# EAGLE schematic Thetis_RevG2_SCH v1 (EAGLE 9.7.0)
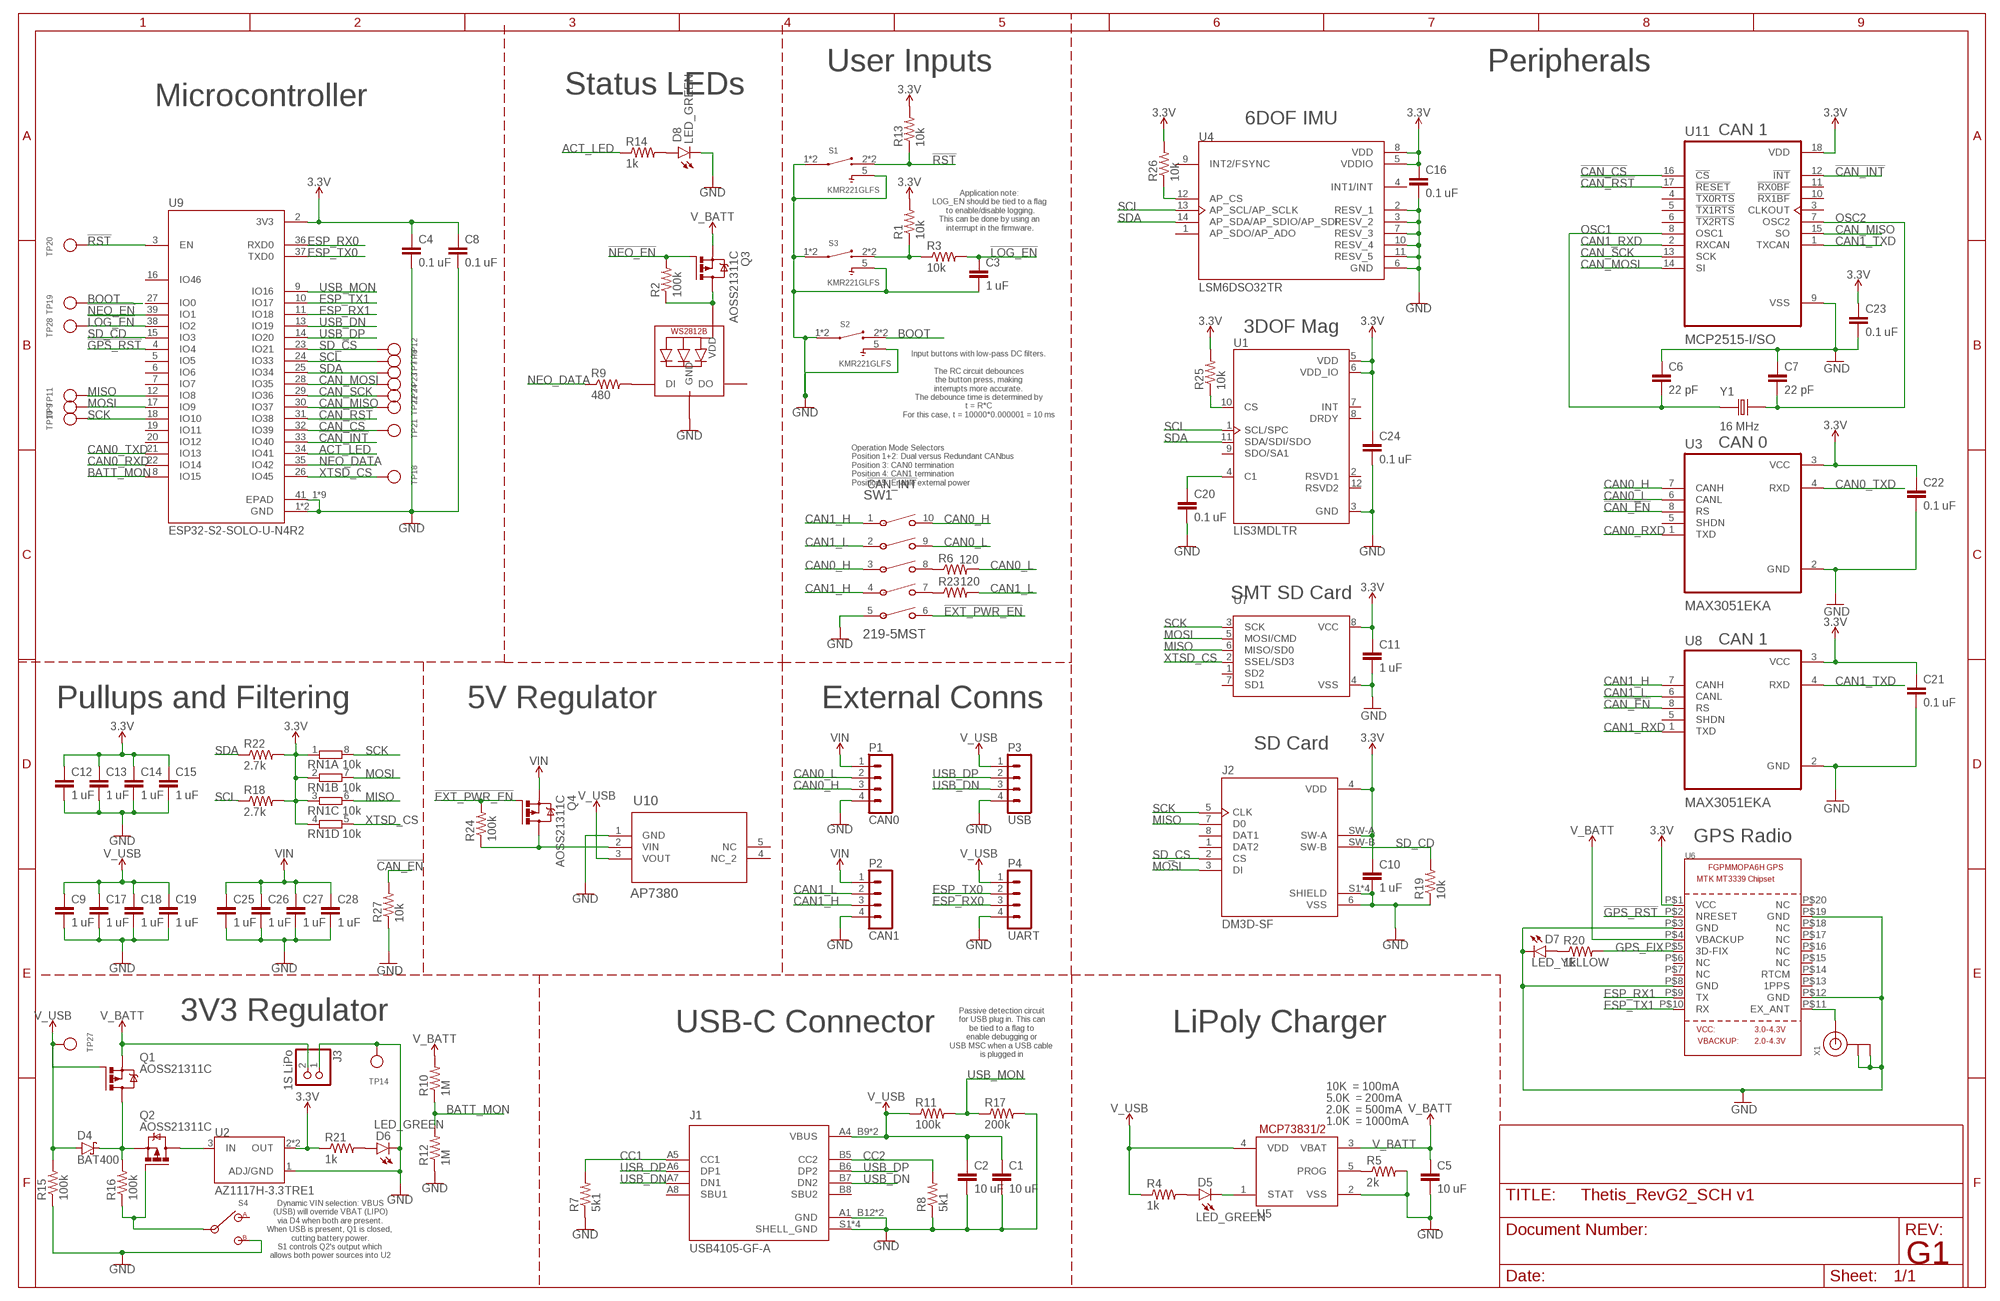
[diagram p0: schematic, sheet 1]

## Parts
C1  10 uF  C-EUC0603  [C0603]
C2  10 uF  C-EUC0603  [C0603]
C3  1 uF  C-EUC0603  [C0603]
C4  0.1 uF  C-EUC0603  [C0603]
C5  10 uF  C-EUC0603  [C0603]
C6  22 pF  C-EUC0603  [C0603]
C7  22 pF  C-EUC0603  [C0603]
C8  0.1 uF  C-EUC0603  [C0603]
C9  1 uF  C-EUC0603  [C0603]
C10  1 uF  C-EUC0603  [C0603]
C11  1 uF  C-EUC0603  [C0603]
C12  1 uF  C-EUC0603  [C0603]
C13  1 uF  C-EUC0603  [C0603]
C14  1 uF  C-EUC0603  [C0603]
C15  1 uF  C-EUC0603  [C0603]
C16  0.1 uF  C-EUC0603  [C0603]
C17  1 uF  C-EUC0603  [C0603]
C18  1 uF  C-EUC0603  [C0603]
C19  1 uF  C-EUC0603  [C0603]
C20  0.1 uF  C-EUC0603  [C0603]
C21  0.1 uF  C-EUC0603  [C0603]
C22  0.1 uF  C-EUC0603  [C0603]
C23  0.1 uF  C-EUC0603  [C0603]
C24  0.1 uF  C-EUC0603  [C0603]
C25  1 uF  C-EUC0603  [C0603]
C26  1 uF  C-EUC0603  [C0603]
C27  1 uF  C-EUC0603  [C0603]
C28  1 uF  C-EUC0603  [C0603]
D4  BAT400  BAS40  [SOT23]
D5  LED_GREEN  CHIP-ROUND-G_0603  [LEDC1608X65N_RND-G]
D6  LED_GREEN  CHIP-ROUND-G_0603  [LEDC1608X65N_RND-G]
D7  LED_YELLOW  CHIP-FLAT-Y_0603-0.35MM  [LEDC1608X35N_FLAT-Y]
D8  LED_GREEN  CHIP-ROUND-G_0603  [LEDC1608X65N_RND-G]
J1  USB4105-GF-A  [GCT_USB4105-GF-A]
J2  DM3D-SF  [HRS_DM3D-SF]
J3  1S LiPo  JST_2PIN  [JSTPH2]
LED1  WS2812B3535  [LED3535]
P1  CAN0  B4B-PH-K  [B4B-PH-K]
P2  CAN1  B4B-PH-K  [B4B-PH-K]
P3  USB  B4B-PH-K  [B4B-PH-K]
P4  UART  B4B-PH-K  [B4B-PH-K]
Q1  AOSS21311C  PMOSFET_BSS84  [SOT23]
Q2  AOSS21311C  PMOSFET_BSS84  [SOT23]
Q3  AOSS21311C  PMOSFET_BSS84  [SOT23]
Q4  AOSS21311C  PMOSFET_BSS84  [SOT23]
R1  10k  R-US_R0603  [R0603]
R2  100k  R-US_R0603  [R0603]
R3  10k  R-US_R0603  [R0603]
R4  1k  R-US_R0603  [R0603]
R5  2k  R-US_R0603  [R0603]
R6  120  R-US_R0603  [R0603]
R7  5k1  R-US_R0603  [R0603]
R8  5k1  R-US_R0603  [R0603]
R9  480  R-US_R0603  [R0603]
R10  1M  R-US_R0603  [R0603]
R11  100k  R-US_R0603  [R0603]
R12  1M  R-US_R0603  [R0603]
R13  10k  R-US_R0603  [R0603]
R14  1k  R-US_R0603  [R0603]
R15  100k  R-US_R0603  [R0603]
R16  100k  R-US_R0603  [R0603]
R17  200k  R-US_R0603  [R0603]
R18  2.7k  R-US_R0603  [R0603]
R19  10k  R-US_R0603  [R0603]
R20  1k  R-US_R0603  [R0603]
R21  1k  R-US_R0603  [R0603]
R22  2.7k  R-US_R0603  [R0603]
R23  120  R-US_R0603  [R0603]
R24  100k  R-US_R0603  [R0603]
R25  10k  R-US_R0603  [R0603]
R26  10k  R-US_R0603  [R0603]
R27  10k  R-US_R0603  [R0603]
RN1  10k  4R-NEXBV8V  [EXBV8V]
S1  KMR221GLFS  [SW_KMR221GLFS]
S2  KMR221GLFS  [SW_KMR221GLFS]
S3  KMR221GLFS  [SW_KMR221GLFS]
S4  CL-SB-12X  [CL-SB-12A]
SW1  219-5MST  219-5MSTSW5_219SMT  [SW5_219SMT]
TP7  TESTPOINT1.5X2.0MM_NOCREAM  [PAD-1.5X2.0]
TP8  TESTPOINT1.5X2.0MM_NOCREAM  [PAD-1.5X2.0]
TP9  TESTPOINT1.5X2.0MM_NOCREAM  [PAD-1.5X2.0]
TP10  TESTPOINT1.5X2.0MM_NOCREAM  [PAD-1.5X2.0]
TP11  TESTPOINT1.5X2.0MM_NOCREAM  [PAD-1.5X2.0]
TP12  TESTPOINT1.5X2.0MM_NOCREAM  [PAD-1.5X2.0]
TP14  TESTPOINT1.5X2.0MM_NOCREAM  [PAD-1.5X2.0]
TP18  TESTPOINT1.5X2.0MM_NOCREAM  [PAD-1.5X2.0]
TP19  TESTPOINT1.5X2.0MM_NOCREAM  [PAD-1.5X2.0]
TP20  TESTPOINT1.5X2.0MM_NOCREAM  [PAD-1.5X2.0]
TP21  TESTPOINT1.5X2.0MM_NOCREAM  [PAD-1.5X2.0]
TP22  TESTPOINT1.5X2.0MM_NOCREAM  [PAD-1.5X2.0]
TP23  TESTPOINT1.5X2.0MM_NOCREAM  [PAD-1.5X2.0]
TP24  TESTPOINT1.5X2.0MM_NOCREAM  [PAD-1.5X2.0]
TP27  TESTPOINT1.5X2.0MM_NOCREAM  [PAD-1.5X2.0]
TP28  TESTPOINT1.5X2.0MM_NOCREAM  [PAD-1.5X2.0]
U1  LIS3MDLTR  [XDCR_LIS3MDLTR]
U2  AZ1117H-3.3TRE1  AZ1117EH-5.0TRG1  [SOT230P700X180-4N]
U3  MAX3051EKA  [SOT65P280X145-8N]
U4  LSM6DSO32TR  [PQFN50P300X250X97-14N]
U5  MCP73831/OT  [SOT23-5L]
U6  GPS_FGPMMOPA6H  [FGPMMOPA6H]
U7  SMT_SDCARD_8PIN  [LGA8_8X6]
U8  MAX3051EKA  [SOT65P280X145-8N]
U9  ESP32-S2-SOLO-U-N4R2  [XCVR_ESP32-S2-SOLO-U-N4R2]
U10  AP7380  AP7380-50WR-7SOT_50WR-7_DIO-L  [SOT_50WR-7_DIO-L]
U11  MCP2515-I/SO  [SOIC127P1030X265-18N]
X1  ANTENNA_U.FL  [U.FL]
Y1  16 MHz  ECS-160-20-3X-TR  [XTAL_ECS-160-20-3X-TR]

## Nets
3.3V: C4.1 C8.1 C10.1 C11.1 C12.1 C13.1 C14.1 C15.1 C16.1 C21.1 C22.1 C23.1 C24.1 J2.4(VDD) J2.SW-A R1.2 R13.2 R18.2 R21.1 R22.2 R25.2 R26.2 RN1.1 RN1.2 RN1.3 RN1.4 U1.5(VDD) U1.6(VDD_IO) U2.2(OUT) U2.4(OUT) U3.3(VCC) U4.5(VDDIO) U4.8(VDD) U6.P$1(VCC) U7.8(VCC) U8.3(VCC) U9.2(3V3) U11.18(VDD)
!CAN_CS: TP21.P$1 U9.32(IO39) U11.16(!CS)
!CAN_EN: R27.2 U3.8(RS) U8.8(RS)
!CAN_INT: U9.33(IO40) U11.12(!INT)
!CAN_RST: U9.31(IO38) U11.17(!RESET)
!EXT_PWR_EN: Q4.1(G) R24.2 SW1.6
!GPS_RST: U6.P$2(NRESET) U9.4(IO4)
!LOG_EN: C3.1 R3.2 TP28.P$1 U9.38(IO2)
!NEO_EN: Q3.1(G) R2.2 U9.39(IO1)
!RST: R13.1 S1.2 S1.3 TP20.P$1 U9.3(EN)
ACT_LED: R14.1 U9.34(IO41)
BATT_MON: R10.1 R12.2 U9.8(IO15)
BOOT: S2.2 S2.3 TP19.P$1 U9.27(IO0)
CAN0_H: P1.3 SW1.3 SW1.10 U3.7(CANH)
CAN0_L: P1.2 R6.2 SW1.9 U3.6(CANL)
CAN0_RXD: U3.1(TXD) U9.22(IO14)
CAN0_TXD: U3.4(RXD) U9.21(IO13)
CAN1_H: P2.3 SW1.1 SW1.4 U8.7(CANH)
CAN1_L: P2.2 R23.2 SW1.2 U8.6(CANL)
CAN1_RXD: U8.1(TXD) U11.2(RXCAN)
CAN1_TXD: U8.4(RXD) U11.1(TXCAN)
CAN_MISO: TP22.P$1 U9.30(IO37) U11.15(SO)
CAN_MOSI: TP23.P$1 U9.28(IO35) U11.14(SI)
CAN_SCK: TP24.P$1 U9.29(IO36) U11.13(SCK)
CC1: J1.A5(CC1) R7.2
CC2: J1.B5(CC2) R8.2
ESP_RX0: P4.3 U9.36(RXD0)
ESP_RX1: U6.P$9(TX) U9.11(IO18)
ESP_TX0: P4.2 U9.37(TXD0)
ESP_TX1: U6.P$10(RX) U9.10(IO17)
GND: C1.2 C2.2 C3.2 C4.2 C5.2 C6.1 C7.1 C8.2 C9.2 C10.2 C11.2 C12.2 C13.2 C14.2 C15.2 C16.2 C17.2 C18.2 C19.2 C20.2 C21.2 C22.2 C23.2 C24.2 C25.2 C26.2 C27.2 C28.2 D6.C D7.C D8.C J1.A1_B12(GND) J1.B1_A12(GND) J1.S1(SHELL_GND) J1.S2(SHELL_GND) J1.S3(SHELL_GND) J1.S4(SHELL_GND) J2.6(VSS) J2.S1(SHIELD) J2.S2(SHIELD) J2.S3(SHIELD) J2.S4(SHIELD) J3.1 LED1.4(GND) P1.4 P2.4 P3.4 P4.4 R5.2 R7.1 R8.1 R12.1 R15.1 R17.2 R19.1 R27.1 S1.1 S1.4 S1.5 S2.1 S2.4 S2.5 S3.1 S3.4 S3.5 S4.3 SW1.5 TP14.P$1 U1.3(GND) U2.1(ADJ/GND) U3.2(GND) U4.2(RESV_1) U4.3(RESV_2) U4.6(GND) U4.7(RESV_3) U4.10(RESV_4) U4.11(RESV_5) U5.2(VSS) U6.P$3(GND) U6.P$8(GND) U6.P$12(GND) U6.P$19(GND) U7.4(VSS) U8.2(GND) U9.1(GND) U9.40(GND) U9.41_1(EPAD) U9.41_2(EPAD) U9.41_3(EPAD) U9.41_4(EPAD) U9.41_5(EPAD) U9.41_6(EPAD) U9.41_7(EPAD) U9.41_8(EPAD) U9.41_9(EPAD) U10.1(GND) U11.9(VSS) X1.1(GND) X1.2(GND)
GPS_FIX: R20.2 U6.P$5(3D-FIX)
MISO: J2.7(D0) RN1.6 TP11.P$1 U7.6(MISO/SD0) U9.12(IO8)
MOSI: J2.3(DI) RN1.7 TP9.P$1 U7.5(MOSI/CMD) U9.17(IO9)
N$1: Q2.1(G) R16.1 S4.2
N$2: D7.A R20.1
N$3: D8.A R14.2
N$4: R1.1 R3.1 S3.2 S3.3
N$5: LED1.2(VDD) Q3.3(D) R2.1
N$6: Q2.3(D) U2.3(IN)
N$7: C20.1 U1.4(C1)
N$8: LED1.1(DI) R9.2
N$10: U6.P$11(EX_ANT) X1.3(SIGNAL)
N$11: R6.1 SW1.8
N$12: R26.1 U4.12(AP_CS)
N$13: D4.3(C) Q1.3(D) Q2.2(S) R16.2
N$14: R23.1 SW1.7
N$15: R25.1 U1.10(CS)
N$16: Q4.3(D) R24.1 U10.2(VIN)
N$20: D5.A R4.2
N$21: D5.C U5.1(STAT)
N$22: R5.1 U5.5(PROG)
N$24: D6.A R21.2
NEO_DATA: R9.1 U9.35(IO42)
OSC1: C6.2 U11.8(OSC1) Y1.1
OSC2: C7.2 U11.7(OSC2) Y1.2
SCK: J2.5(CLK) RN1.8 TP10.P$1 U7.3(SCK) U9.18(IO10)
SCL: R18.1 TP8.P$1 U1.1(SCL/SPC) U4.13(AP_SCL/AP_SCLK) U9.24(IO33)
SD_CD: J2.SW-B R19.2 U9.15(IO3)
SD_CS: J2.2(CS) TP12.P$1 U9.23(IO21)
SDA: R22.1 TP7.P$1 U1.11(SDA/SDI/SDO) U4.14(AP_SDA/AP_SDIO/AP_SDI) U9.25(IO34)
USB_DN: J1.A7(DN1) J1.B7(DN2) P3.3 U9.13(IO19)
USB_DP: J1.A6(DP1) J1.B6(DP2) P3.2 U9.14(IO20)
USB_MON: R11.2 R17.1 U9.9(IO16)
V_BATT: C5.1 J3.2 Q1.2(S) Q3.2(S) R10.2 U5.3(VBAT) U6.P$4(VBACKUP)
V_USB: C1.1 C2.1 C9.1 C17.1 C18.1 C19.1 D4.1(A) J1.A4_B9(VBUS) J1.B4_A9(VBUS) P3.1 P4.1 Q1.1(G) R4.1 R11.1 R15.2 TP27.P$1 U5.4(VDD) U10.3(VOUT)
VIN: C25.1 C26.1 C27.1 C28.1 P1.1 P2.1 Q4.2(S)
XTSD_CS: RN1.5 TP18.P$1 U7.2(SSEL/SD3) U9.26(IO45)
Unconnected: J1.A8(SBU1) J1.B8(SBU2) J2.1(DAT2) J2.8(DAT1) LED1.3(DO) S4.1 U1.2(RSVD1) U1.7(INT) U1.8(DRDY) U1.9(SDO/SA1) U1.12(RSVD2) U3.5(SHDN) U4.1(AP_SDO/AP_ADO) U4.4(INT1/INT) U4.9(INT2/FSYNC) U6.P$6(NC) U6.P$7(NC) U6.P$13(1PPS) U6.P$14(RTCM) U6.P$15(NC) U6.P$16(NC) U6.P$17(NC) U6.P$18(NC) U6.P$20(NC) U7.1(SD2) U7.7(SD1) U8.5(SHDN) U9.5(IO5) U9.6(IO6) U9.7(IO7) U9.16(IO46) U9.19(IO11) U9.20(IO12) U10.4(NC_2) U10.5(NC) U11.3(CLKOUT) U11.4(!TX0RTS) U11.5(!TX1RTS) U11.6(!TX2RTS) U11.10(!RX1BF) U11.11(!RX0BF)

## Notes on the sheet
- User Inputs | Peripherals
- Status LEDs
- Microcontroller
- 6DOF IMU
- CAN 1
- Application note: 
  LOG_EN should be tied to a flag 
  to enable/disable logging.
  This can be done by using an 
  interrrupt in the firmware.
- 3DOF Mag
- Input buttons with low-pass DC filters.
  
  The RC circuit debounces
  the button press, making
  interrupts more accurate.
  The debounce time is determined by
  t = R*C
  For this case, t = 10000*0.000001 = 10 ms
- CAN 0
- Operation Mode Selectors
  Position 1+2: Dual versus Redundant CANbus
  Position 3: CAN0 termination
  Position 4: CAN1 termination
  Position 5: Enable external power
- SMT SD Card
- CAN 1
- Pullups and Filtering | 5V Regulator | External Conns
- SD Card
- GPS Radio
- 3V3 Regulator
- USB-C Connector | LiPoly Charger
- Passive detection circuit
  for USB plug in. This can
  be tied to a flag to
  enable debugging or
  USB MSC when a USB cable 
  is plugged in
- 10K  = 100mA
- 5.0K  = 200mA
- 2.0K  = 500mA
- 1.0K  = 1000mA
- Dynamic VIN selection: VBUS
  (USB) will override VBAT (LIPO)
  via D4 when both are present.
  When USB is present, Q1 is closed, 
  cutting battery power.
  S1 controls Q2's output which 
  allows both power sources into U2
- G1

## Library data of the parts
C1-C28 = rcl:C-EU: CAPACITOR, European symbol; SPICEPREFIX: C
D4 = diode:BAS40: Silicon Schottky Diodes General-purpose diode for high-speed switching
D5 D6 D8 = LED:CHIP-ROUND-G; CATEGORY: LED; COLOR: GREEN; DESCRIPTION: CHIP LED ROUND; SUB-CATEGORY: CHIP; TYPE: ROUND_TOP
D7 = LED:CHIP-FLAT-Y; CATEGORY: LED; COLOR: YELLOW; DESCRIPTION: CHIP LED FLAT; SUB-CATEGORY: CHIP; TYPE: FLAT_TOP
J1 = USB4105-GF-A:USB4105-GF-A: USB-C (USB TYPE-C) USB 2.0 Receptacle Connector 24 (16+8 Dummy) Position Surface Mount, Right Angle; Through Hole Check prices <https://pricing.snapeda.com/parts/USB4105-GF-A/GCT/view-part?ref=eda>; AVAILABILITY: In Stock; DESCRIPTION: USB-C (USB TYPE-C) USB 2.0 Receptacle Connector 24 (16+8 Dummy) Position Surface Mount, Right Angle; Through Hole; MF: GCT; MP: USB4105-GF-A; PACKAGE: None; PRICE: None; PURCHASE-URL: https://pricing.snapeda.com/search/part/USB4105-GF-A/?ref=eda
J2 = UTL-Lib:DM3D-SF: Right Angle SMT Top Board Mount Push-Pull No Ejection MicroSD Connector; MANUFACTURER: Hirose; MAXIMUM_PACKAGE_HEIGHT: 1.55mm; PARTREV: 2017.1; STANDARD: Manufacturer Recommendations
J3 = UTL-Lib:JST_2PIN: JST 2-Pin Right-Angle Connector PH-Series - 4UConnector: 17311 SH-Series - 4UConnector: 07278
LED1 = UTL-Lib:WS2812B
P1-P4 = con-jst-ph:B4B-PH-K: HEADER
Q1-Q4 = Transistor:PMOSFET_: P-Channel MOSFET - Popular parts; CATEGORY: Transistor; DESCRIPTION: MOSFET P-CH 50V 130MA SOT-23; DRAIN_CURRENT: 130mA; MANUFACTURER: ON Semiconductor; MPN: BSS84; OPERATING_TEMP: -55°C ~ 150°C; PART_STATUS: Active; ROHS_COMPLIANT: Yes; SUB-CATEGORY: MOSFET; THERMALLOSS: 360mW; TYPE: P-Channel; VALUE: BSS84
R1-R27 = rcl:R-US_: RESISTOR, American symbol; SPICEPREFIX: R
RN1 = resistor-dil-Poseidon-Edit:4R-N: Array Chip Resistor Source: RS Component / Phycomp; OC_FARNELL: unknown; OC_NEWARK: unknown
S1-S3 = KMR221GLFS:KMR221GLFS: Switch Tactile N.O. SPST Button Gull Wing 0.05A 32VDC 1VA 200000Cycles 2N SMD Automotive T/R; MANUFACTURER: CnK
S4 = switches:CL-SB-12X: SWITCH SLIDE SPDT 0.2A JLEAD; DIGIKEY: 563-1314-1-ND
SW1 = UTL-Lib:219-5MST; COPYRIGHT: Copyright (C) 2022 Ultra Librarian. All rights reserved.; DIGI-KEY_PART_NUMBER_1: CT2195MST-ND; MANUFACTURER_PART_NUMBER: 219-5MST; MFR_NAME: CTS Components
TP7-TP12 TP14 TP18-TP24 TP27 TP28 = microbuilder:TESTPOINT: Test Point Various test points for characterisation and PCB testing TESTPOINT_SMT - Compact Surface Mount Test Point [Digikey: 5016KTR-ND]
U1 = UTL-Lib:LIS3MDLTR: LIS3MDL Series 3 Axis ±2/±8/±12/±16 g 3.6V High Performance Magnetometer LGA-12; AVAILABILITY: Unavailable; DESCRIPTION: LIS3MDL Series 3 Axis ±2/±8/±12/±16 g 3.6V High Performance Magnetometer LGA-12; MAXIMUM_PACKAGE_HEIGHT: 1mm; MF: STMicroelectronics; MP: LIS3MDLTR; PACKAGE: VFLGA-12 STMicroelectronics; PARTREV: 6; PRICE: None; STANDARD: Manufacturer Recommendation
U2 = AZ1117EH-5.0TRG1:AZ1117EH-5.0TRG1; ARROW_ELECTRONICS-PURCHASE-URL: https://snapeda.com/shop?store=Arrow+Electronics&id=482930; AVAILABILITY: Good; DESCRIPTION: Linear Voltage Regulator IC 1 Output 1A SOT-223; DIGIKEY-PURCHASE-URL: https://snapeda.com/shop?store=DigiKey&id=482930; MF: Diodes Inc.; MOUSER-PURCHASE-URL: https://snapeda.com/shop?store=Mouser&id=482930; MP: AZ1117EH-5.0TRG1; PACKAGE: SOT-223 Diodes Inc.; PRICE: None
U3 U8 = UTL-Lib:MAX3051EKA; DESCRIPTION: 1/1 Transceiver Half CANbus SOT-23-8; DIGI-KEY_PART_NUMBER: MAX3051EKA+TTR-ND; MF: Maxim Integrated; MP: MAX3051EKA+T; PACKAGE: SOT-23-8 Maxim; PURCHASE-URL: https://pricing.snapeda.com/search/part/MAX3051EKA+T/?ref=eda
U4 = UTL-Lib:LSM6DSO32TR: Single-Interface MotionTracking device The ICM-42605 is a 6-axis MotionTracking device that combines a 3-axis gyroscope, and a 3-axis accelerometer in a small 2.5x3x0.91 mm (14-pin LGA) package. It also features a 2K-byte FIFO that can lower the traffic on the serial bus interface, and reduce power consumption by allowing the system processor to burst read sensor data and then go into a low-power mode.; MANUFACTURER: TDK Corporation; PARTREV: 0.4; STANDARD: IPC 7351B
U5 = adafruit - EVE Edit:MCP73831: MCP73831/2 Miniature Single-Cell, Fully Integrated Li-Ion, Li-Polymer Charge Management Controllers. Nice and small simple lipoly charge controller, with adjustable current and status output (LED) http://www.ladyada.net/library/pcb/eaglelibrary.html
U6 = adafruit - EVE Edit:GPS_FGPMMOPA6H: GPS Module - MTK MT3339 Chipset, -165dBm sensitivity, 22 channels, 10Hz, auto-select external antenna options
U7 = UTL-Lib:SMT_SDCARD_8PIN: SOIC8 SPI Flash Be careful with the size since SOIC8 flash comes in several 'widths' SOIC8 150 mil M25P16 - 16Mbit (2Mbit x 8) Serial Flash (75MHz SPI Bus), Supply: 2.7-3.6V Digikey: SOIC8 - M25P16-VMN6P-ND SOIC8 208 mil W25Q16BVSSIG - 16Mbit (2Mbit x 8) Serial Flash (104MHz SPI Bus), Supply: 2.7-3.6V Digikey: SOIC8 - W25Q16BVSSIG-ND
U9 = UTL-Lib:ESP32-S2-SOLO-U-N4R2; MANUFACTURER: Espressif Systems; MAXIMUM_PACKAGE_HEIGHT: 3.35 mm; PARTREV: 1.4; SNAPEDA_PN: ESP32-S2-SOLO-U-N4R2; STANDARD: Manufacturer Recommendations
U10 = UTL-Lib:AP7380-50WR-7; COPYRIGHT: Copyright (C) 2022 Ultra Librarian. All rights reserved.; DIGI-KEY_PART_NUMBER_1: AP7380-50WR-7DITR-ND; DIGI-KEY_PART_NUMBER_2: AP7380-50WR-7DICT-ND; DIGI-KEY_PART_NUMBER_3: AP7380-50WR-7DIDKR-ND; MANUFACTURER_PART_NUMBER: AP7380-50WR-7; MFR_NAME: Diodes Inc
U11 = UTL-Lib:MCP2515-I/SO
X1 = adafruit - EVE Edit:ANTENNA_U.FL: U.FL Antenna Connector
Y1 = UTL-Lib:ECS-160-20-3X-TR: SMD QUARTZ CRYSTAL; MANUFACTURER: ECS INC.; PARTREV: 2017; STANDARD: Manufacturer recommendations

## Net classes
0 default: width 0.178 mm